# EAGLE design WORD_BYTE_1 (EAGLE 6.5.0)
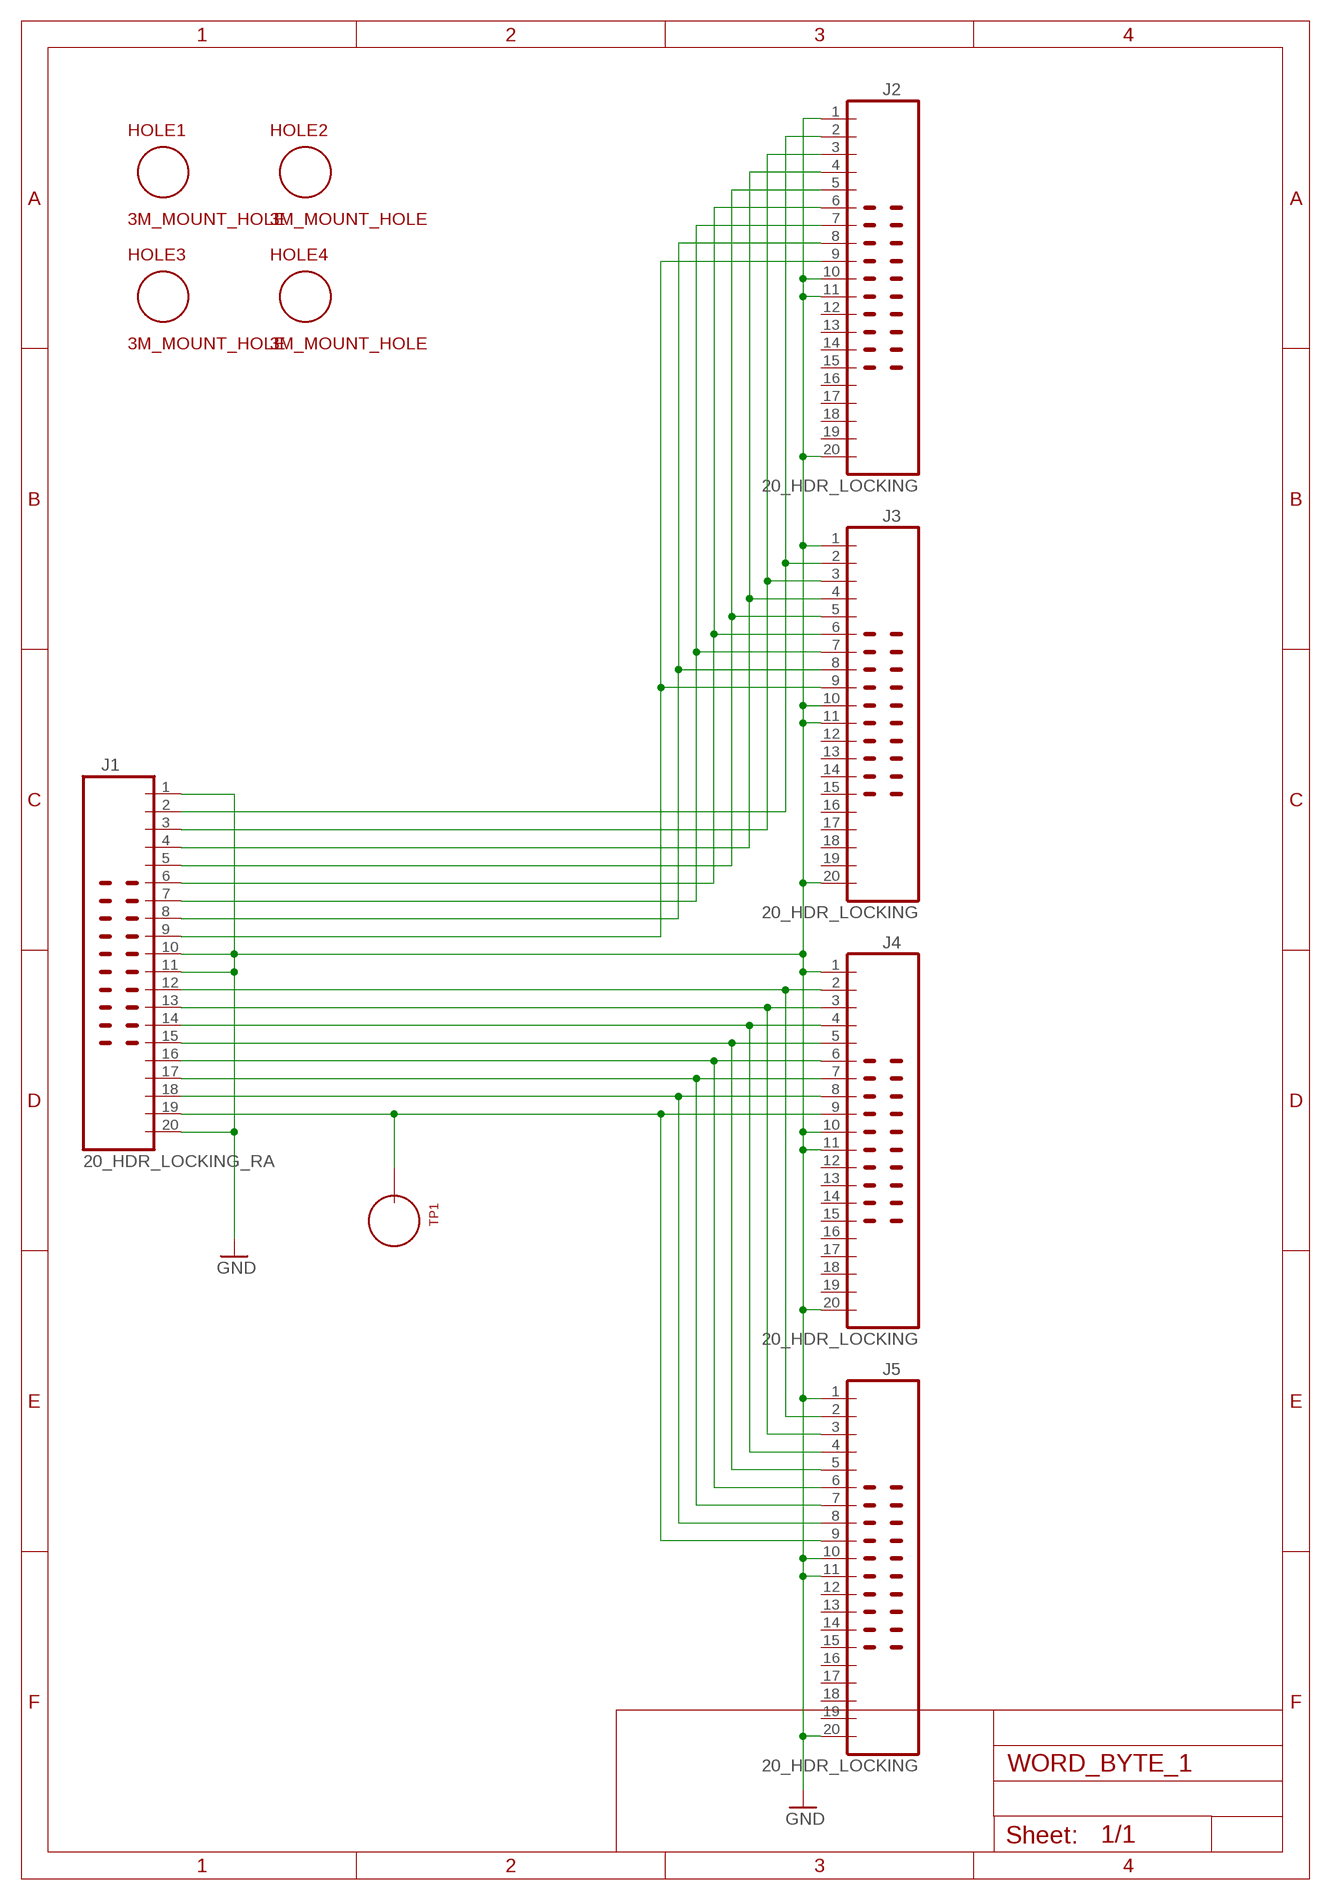
[diagram p0: schematic, sheet 1]

## Parts
HOLE1  3M_MOUNT_HOLE  [3M_HOLE]
HOLE2  3M_MOUNT_HOLE  [3M_HOLE]
HOLE3  3M_MOUNT_HOLE  [3M_HOLE]
HOLE4  3M_MOUNT_HOLE  [3M_HOLE]
J1  20_HDR_LOCKING_RA  [20_HDR_LOCKING_RA]
J2  20_HDR_LOCKING  [20_HDR_LOCKING]
J3  20_HDR_LOCKING  [20_HDR_LOCKING]
J4  20_HDR_LOCKING  [20_HDR_LOCKING]
J5  20_HDR_LOCKING  [20_HDR_LOCKING]
TP1  TEST_LOOP  [TEST_LOOP]

## Nets
GND: J1.1 J1.10 J1.11 J1.20 J2.1 J2.10 J2.11 J2.20 J3.1 J3.10 J3.11 J3.20 J4.1 J4.10 J4.11 J4.20 J5.1 J5.10 J5.11 J5.20
N$2: J1.2 J2.2 J3.2
N$13: J1.13 J4.3 J5.3
N$15: J1.15 J4.5 J5.5
N$17: J1.17 J4.7 J5.7
N$19: J1.19 J4.9 J5.9 TP1.P$1
N$43: J1.18 J4.8 J5.8
N$45: J1.16 J4.6 J5.6
N$47: J1.14 J4.4 J5.4
N$49: J1.12 J4.2 J5.2
N$50: J1.9 J2.9 J3.9
N$51: J1.8 J2.8 J3.8
N$52: J1.7 J2.7 J3.7
N$53: J1.6 J2.6 J3.6
N$54: J1.5 J2.5 J3.5
N$55: J1.4 J2.4 J3.4
N$56: J1.3 J2.3 J3.3
Unconnected: J2.12 J2.13 J2.14 J2.15 J2.16 J2.17 J2.18 J2.19 J3.12 J3.13 J3.14 J3.15 J3.16 J3.17 J3.18 J3.19 J4.12 J4.13 J4.14 J4.15 J4.16 J4.17 J4.18 J4.19 J5.12 J5.13 J5.14 J5.15 J5.16 J5.17 J5.18 J5.19

## Library data of the parts
HOLE1-HOLE4 = MyLib:3M_MOUNT_HOLE
J1 = MyLib:20_HDR_LOCKING_RA
J2-J5 = MyLib:20_HDR_LOCKING
TP1 = MyLib:TEST_LOOP

## Board
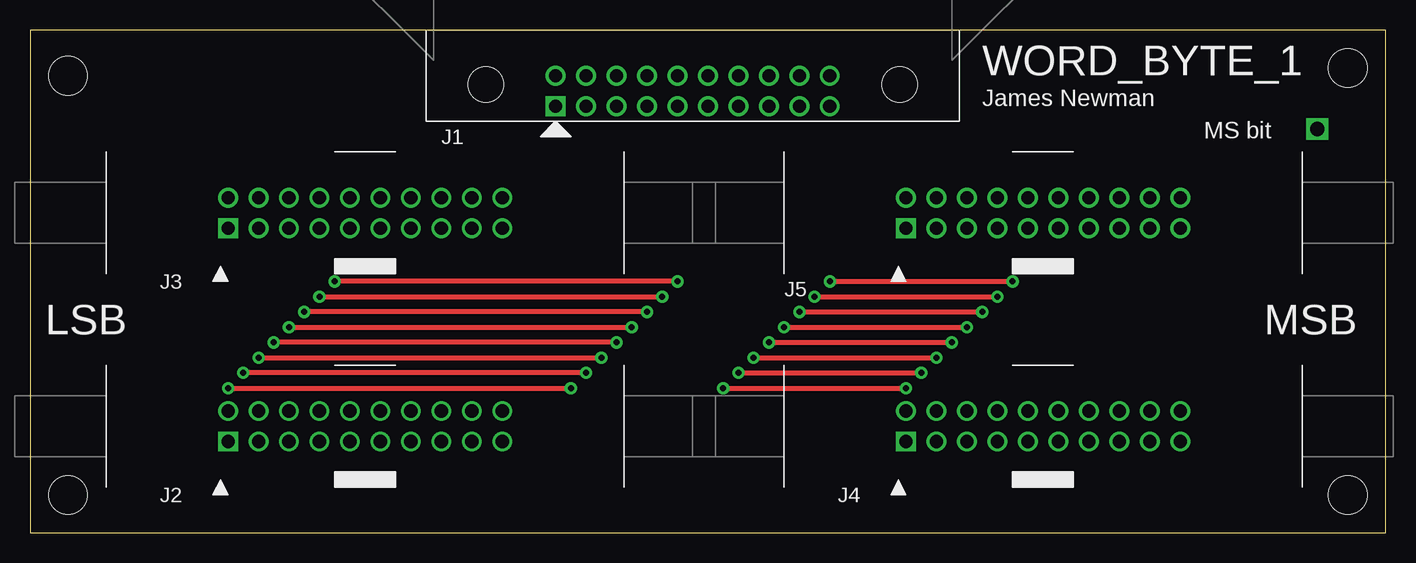
[diagram p1: board, top side]
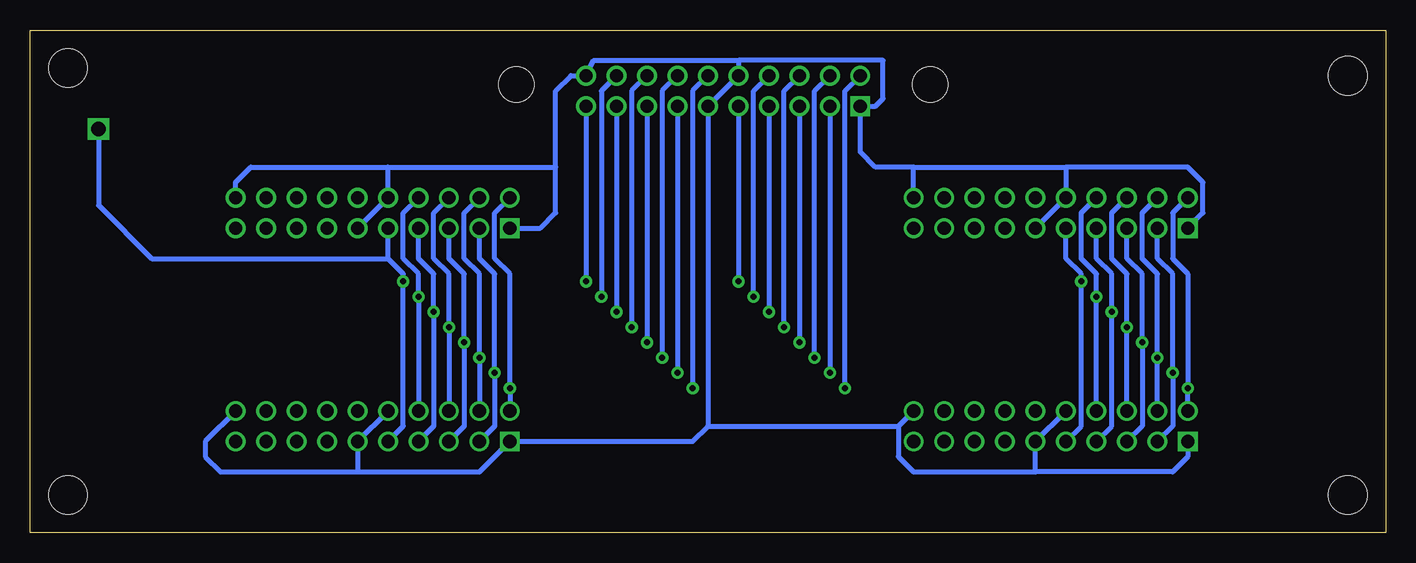
[diagram p2: board, bottom side, seen from below]

Size 113.03 x 41.91 mm. Coordinates in mm from the lower left corner, seen from the top.
Outline: 113.03,0 113.03,41.91 0,41.91 0,0 113.03,0
Copper layers (1*16): Top 0.035mm / dielectric 1.5mm / Bottom 0.035mm
Design rules "processor_rules_2layer": minimum track width 8mil, minimum drill 14mil, track to track 8mil, track to pad 8mil, pad to pad 8mil, via to via 8mil, smd to smd 8mil, copper to edge 40mil, drill to drill 8mil, minimum pad ring 10mil, minimum via ring 8mil, stop-mask expansion 4mil, vias tented up to drill 0.7mm, thermal gap 10mil

### Footprints (pad centres in the part's own frame; a part is rotated, then mirrored left to right if it is on the bottom)
3M_HOLE = hole 3.2: 0,0
20_HDR_LOCKING_RA = drill 1.1 square: 1 -11.43,-1.27 | drill 1.1: 2 -11.43,1.27; 3 -8.89,-1.27; 4 -8.89,1.27; 5 -6.35,-1.27; 6 -6.35,1.27; 7 -3.81,-1.27; 8 -3.81,1.27; 9 -1.27,-1.27; 10 -1.27,1.27; 11 1.27,-1.27; 12 1.27,1.27; 13 3.81,-1.27; 14 3.81,1.27; 15 6.35,-1.27; 16 6.35,1.27; 17 8.89,-1.27; 18 8.89,1.27; 19 11.43,-1.27; 20 11.43,1.27 | hole 2.946: -17.247,0.533; 17.247,0.533
20_HDR_LOCKING = drill 1.1 square: 1 -1.27,11.43 | drill 1.1: 2 1.27,11.43; 3 -1.27,8.89; 4 1.27,8.89; 5 -1.27,6.35; 6 1.27,6.35; 7 -1.27,3.81; 8 1.27,3.81; 9 -1.27,1.27; 10 1.27,1.27; 11 -1.27,-1.27; 12 1.27,-1.27; 13 -1.27,-3.81; 14 1.27,-3.81; 15 -1.27,-6.35; 16 1.27,-6.35; 17 -1.27,-8.89; 18 1.27,-8.89; 19 -1.27,-11.43; 20 1.27,-11.43
TEST_LOOP = drill 1.2 square: P$1 0,0

### Placement (x,y rotation side)
HOLE1  109.86,38.73 90 top
HOLE2  3.17,38.1 90 top
HOLE3  109.86,3.17 90 top
HOLE4  3.17,3.17 90 top
J1  55.24,36.83 0 top
J2  27.94,8.89 90 top
J3  27.94,26.67 90 top
J4  84.45,8.89 90 top
J5  84.45,26.67 90 top
TP1  107.31,33.66 90 top

### Tracks (layer width: path | path; a pad name or v marks a point on that pad's centre or on a via)
GND
  Bottom 0.406: J2.1 16.51,6.35 17.78,5.08 29.21,5.08 | 29.21,5.08 J2.11 J2.10 | J3.11 J3.10 26.67,30.48 | J3.1 15.24,26.67 15.24,29.21 16.51,30.48 26.67,30.48 | J2.20 40.64,8.89 | 40.64,8.89 40.64,6.35 39.37,5.08 29.21,5.08 | 56.52,8.89 57.78,7.62 J4.1 75.56,5.08 85.72,5.08 | 56.52,8.89 40.64,8.89 | 56.52,8.89 J1.11 J1.10 53.98,39.37 | J4.20 98.42,7.62 98.42,6.35 97.16,5.08 85.72,5.08 | 85.72,5.08 J4.11 J4.10 | J3.20 39.37,30.48 | 39.37,30.48 26.67,30.48 | 39.37,30.48 42.55,30.48 43.81,31.75 J1.1 42.55,35.56 41.91,36.2 41.91,39.37 53.98,39.37 | J5.20 95.89,29.21 94.61,30.48 83.19,30.48 | 83.19,30.48 69.22,30.48 | 69.22,30.48 69.22,36.83 67.94,38.1 J1.20 66.04,39.37 53.98,39.37 | 83.19,30.48 J5.10 J5.11 | J5.1 70.48,25.4 69.22,26.67 69.22,30.48
N$2  (via drill 0.5 pad 1.02)
  Top 0.406: v16.51,12.06 v45.09,12.06
  Bottom 0.406: J3.2 17.78,26.67 17.78,22.86 16.51,21.59 v16.51,12.06 J2.2 | v45.09,12.06 45.09,36.83 J1.2
N$13  (via drill 0.5 pad 1.02)
  Top 0.406: v59.05,13.34 v74.3,13.34
  Bottom 0.406: J1.13 v59.05,13.34 | J4.3 74.3,8.89 v74.3,13.34 74.3,21.59 75.56,22.86 J5.3
N$15  (via drill 0.5 pad 1.02)
  Top 0.406: v61.59,15.88 v76.83,15.88
  Bottom 0.406: J1.15 v61.59,15.88 | J4.5 76.83,8.89 v76.83,15.88 76.83,21.59 78.11,22.86 J5.5
N$17  (via drill 0.5 pad 1.02)
  Top 0.406: v64.14,18.41 v79.38,18.41
  Bottom 0.406: J1.17 v64.14,18.41 | J4.7 79.38,8.89 v79.38,18.41 79.38,21.59 80.64,22.86 J5.7
N$19  (via drill 0.5 pad 1.02)
  Top 0.406: v66.67,20.95 v81.92,20.95
  Bottom 0.406: J1.19 v66.67,20.95 | 83.19,22.86 81.92,21.59 v81.92,20.95 81.92,8.89 J4.9 | 83.19,22.86 J5.9 | TP1.P$1 107.31,27.3 102.87,22.86 83.19,22.86
N$43  (via drill 0.5 pad 1.02)
  Top 0.406: v65.41,19.68 v80.64,19.68
  Bottom 0.406: J1.18 65.41,36.83 v65.41,19.68 | J4.8 v80.64,19.68 80.64,21.59 81.92,22.86 81.92,26.67 J5.8
N$45  (via drill 0.5 pad 1.02)
  Top 0.406: v62.87,17.14 v78.11,17.14
  Bottom 0.406: J1.16 62.87,36.83 v62.87,17.14 | J4.6 v78.11,17.14 78.11,21.59 79.38,22.86 79.38,26.67 J5.6
N$47  (via drill 0.5 pad 1.02)
  Top 0.406: v60.33,14.61 v75.56,14.61
  Bottom 0.406: J1.14 60.33,36.83 v60.33,14.61 | J4.4 v75.56,14.61 75.56,21.59 76.83,22.86 76.83,26.67 J5.4
N$49  (via drill 0.5 pad 1.02)
  Top 0.406: v57.78,12.06 v73.03,12.06
  Bottom 0.406: J1.12 57.78,36.83 v57.78,12.06 | J4.2 v73.03,12.06 73.03,21.59 74.3,22.86 74.3,26.67 J5.2
N$50  (via drill 0.5 pad 1.02)
  Top 0.406: v53.98,20.95 v25.4,20.95
  Bottom 0.406: J1.9 v53.98,20.95 | J3.9 26.67,22.86 25.4,21.59 v25.4,20.95 25.4,8.89 J2.9
N$51  (via drill 0.5 pad 1.02)
  Top 0.406: v24.13,19.68 v52.7,19.68
  Bottom 0.406: J2.8 v24.13,19.68 24.13,21.59 25.4,22.86 25.4,26.67 J3.8 | v52.7,19.68 52.7,36.83 J1.8
N$52  (via drill 0.5 pad 1.02)
  Top 0.406: v51.44,18.41 v22.86,18.41
  Bottom 0.406: J1.7 v51.44,18.41 | J3.7 24.13,22.86 22.86,21.59 v22.86,18.41 22.86,8.89 J2.7
N$53  (via drill 0.5 pad 1.02)
  Top 0.406: v21.59,17.14 v50.16,17.14
  Bottom 0.406: J2.6 v21.59,17.14 21.59,21.59 22.86,22.86 22.86,26.67 J3.6 | v50.16,17.14 50.16,36.83 J1.6
N$54  (via drill 0.5 pad 1.02)
  Top 0.406: v48.9,15.88 v20.32,15.88
  Bottom 0.406: J1.5 v48.9,15.88 | J2.5 20.32,8.89 v20.32,15.88 20.32,21.59 21.59,22.86 J3.5
N$55  (via drill 0.5 pad 1.02)
  Top 0.406: v19.05,14.61 v47.62,14.61
  Bottom 0.406: J2.4 v19.05,14.61 19.05,21.59 20.32,22.86 20.32,26.67 J3.4 | v47.62,14.61 47.62,36.83 J1.4
N$56  (via drill 0.5 pad 1.02)
  Top 0.406: v46.35,13.34 v17.78,13.34
  Bottom 0.406: J1.3 v46.35,13.34 | J2.3 17.78,8.89 v17.78,13.34 17.78,21.59 19.05,22.86 J3.3

### Text on the board
tPlace: WORD_BYTE_1 | James Newman | MS bit | LSB | MSB